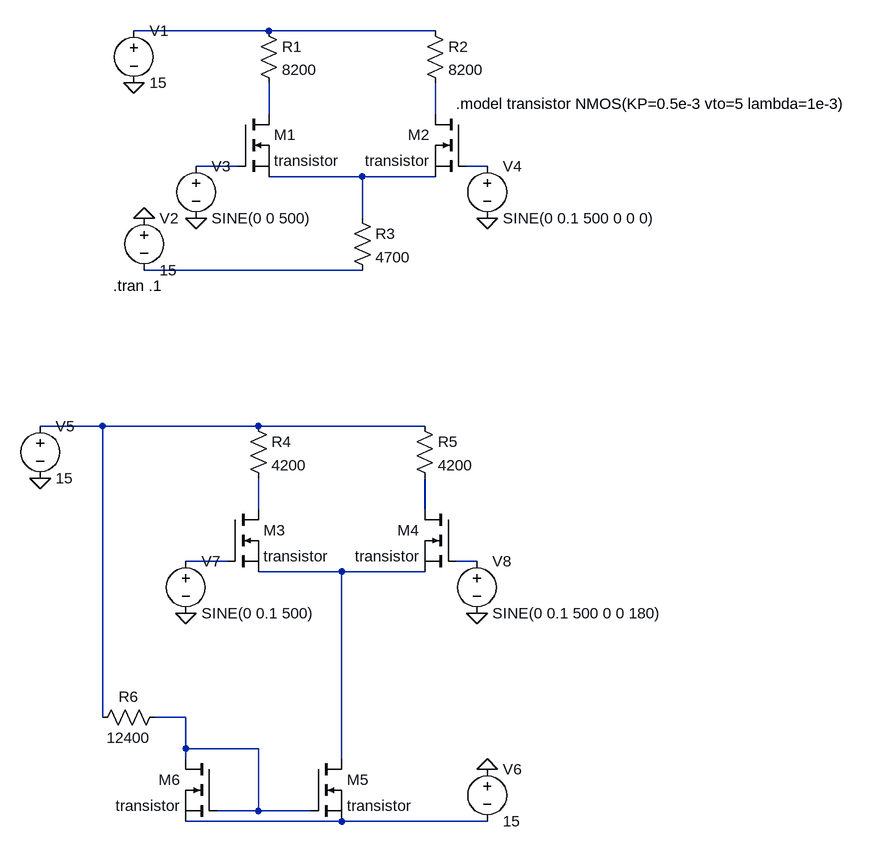
[diagram p0: schematic EA_practica_2.asc]
EA_practica_2.asc, the LTspice schematic file:
Version 4
SHEET 1 1032 1220
WIRE 80 -16 -128 -16
WIRE 336 -16 80 -16
WIRE 80 112 80 64
WIRE 336 112 336 64
WIRE 32 192 -32 192
WIRE 416 192 384 192
WIRE 224 208 80 208
WIRE 336 208 224 208
WIRE 224 272 224 208
WIRE 224 352 -112 352
WIRE -176 592 -272 592
WIRE 64 592 -176 592
WIRE 320 592 64 592
WIRE 64 720 64 672
WIRE 320 720 320 672
WIRE 16 800 -48 800
WIRE 400 800 368 800
WIRE 192 816 64 816
WIRE 320 816 192 816
WIRE -176 1040 -176 592
WIRE -48 1040 -96 1040
WIRE -48 1088 -48 1040
WIRE 64 1088 -48 1088
WIRE -48 1104 -48 1088
WIRE 192 1104 192 816
WIRE 64 1184 64 1088
WIRE 64 1184 0 1184
WIRE 144 1184 64 1184
WIRE 192 1200 -48 1200
WIRE 416 1200 192 1200
FLAG -128 64 0
FLAG -112 272 0
FLAG -32 272 0
FLAG 416 272 0
FLAG -272 672 0
FLAG 416 1120 0
FLAG -48 880 0
FLAG 400 880 0
SYMBOL nmos 32 112 R0
SYMATTR InstName M1
SYMATTR Value transistor
SYMBOL nmos 384 112 M0
SYMATTR InstName M2
SYMATTR Value transistor
SYMBOL res 64 -32 R0
SYMATTR InstName R1
SYMATTR Value 8200
SYMBOL res 320 -32 R0
SYMATTR InstName R2
SYMATTR Value 8200
SYMBOL voltage -128 -32 R0
WINDOW 123 0 0 Left 0
WINDOW 39 0 0 Left 0
SYMATTR InstName V1
SYMATTR Value 15
SYMBOL res 208 256 R0
SYMATTR InstName R3
SYMATTR Value 4700
SYMBOL voltage -112 256 R0
WINDOW 123 0 0 Left 0
WINDOW 39 0 0 Left 0
SYMATTR InstName V2
SYMATTR Value 15
SYMBOL voltage -32 176 R0
WINDOW 123 0 0 Left 0
WINDOW 39 0 0 Left 0
SYMATTR InstName V3
SYMATTR Value SINE(0 0 500)
SYMBOL voltage 416 176 R0
WINDOW 123 0 0 Left 0
WINDOW 39 0 0 Left 0
SYMATTR InstName V4
SYMATTR Value SINE(0 0.1 500 0 0 0)
SYMBOL nmos 16 720 R0
SYMATTR InstName M3
SYMATTR Value transistor
SYMBOL nmos 368 720 M0
SYMATTR InstName M4
SYMATTR Value transistor
SYMBOL res 48 576 R0
SYMATTR InstName R4
SYMATTR Value 4200
SYMBOL res 304 576 R0
SYMATTR InstName R5
SYMATTR Value 4200
SYMBOL voltage -272 576 R0
WINDOW 123 0 0 Left 0
WINDOW 39 0 0 Left 0
SYMATTR InstName V5
SYMATTR Value 15
SYMBOL voltage 416 1104 R0
WINDOW 123 0 0 Left 0
WINDOW 39 0 0 Left 0
SYMATTR InstName V6
SYMATTR Value 15
SYMBOL voltage -48 784 R0
WINDOW 123 0 0 Left 0
WINDOW 39 0 0 Left 0
SYMATTR InstName V7
SYMATTR Value SINE(0 0.1 500)
SYMBOL voltage 400 784 R0
WINDOW 123 0 0 Left 0
WINDOW 39 0 0 Left 0
SYMATTR InstName V8
SYMATTR Value SINE(0 0.1 500 0 0 180)
SYMBOL nmos 144 1104 R0
SYMATTR InstName M5
SYMATTR Value transistor
SYMBOL nmos 0 1104 M0
SYMATTR InstName M6
SYMATTR Value transistor
SYMBOL res -80 1024 R90
WINDOW 0 0 56 VBottom 2
WINDOW 3 32 56 VTop 2
SYMATTR InstName R6
SYMATTR Value 12400
TEXT 368 96 Left 2 !.model transistor NMOS(KP=0.5e-3 vto=5 lambda=1e-3)
TEXT -160 376 Left 2 !.tran .1

The netlist it stands for:
* EA_practica_2.asc
M1 N002 N004 N006 N006 transistor
M2 N003 N005 N006 N006 transistor
R1 N001 N002 8200
R2 N001 N003 8200
V1 N001 0 15
R3 N006 N007 4700
V2 0 N007 15
V3 N004 0 SINE(0 0 500)
V4 N005 0 SINE(0 0.1 500 0 0 0)
M3 N009 N011 N013 N013 transistor
M4 N010 N012 N013 N013 transistor
R4 N008 N009 4200
R5 N008 N010 4200
V5 N008 0 15
V6 0 N015 15
V7 N011 0 SINE(0 0.1 500)
V8 N012 0 SINE(0 0.1 500 0 0 180)
M5 N013 N014 N015 N015 transistor
M6 N014 N014 N015 N015 transistor
R6 N014 N008 12400
.model NMOS NMOS
.model PMOS PMOS
.lib standard.mos
.model transistor NMOS(KP=0.5e-3 vto=5 lambda=1e-3)
.tran .1
.backanno
.end